# EasyEDA Pro project Buck_project.epro

# Schematic Schematic1
Board Name: Board1; Create Date: 2024-10-22; Page Name: P1; Project Name: BUCK_STM32_24V_12V; Schematic Name: Schematic1; Update Date: 2024-11-10; Company: 嘉立创EDA; Page Size: A3; Version: V1.0
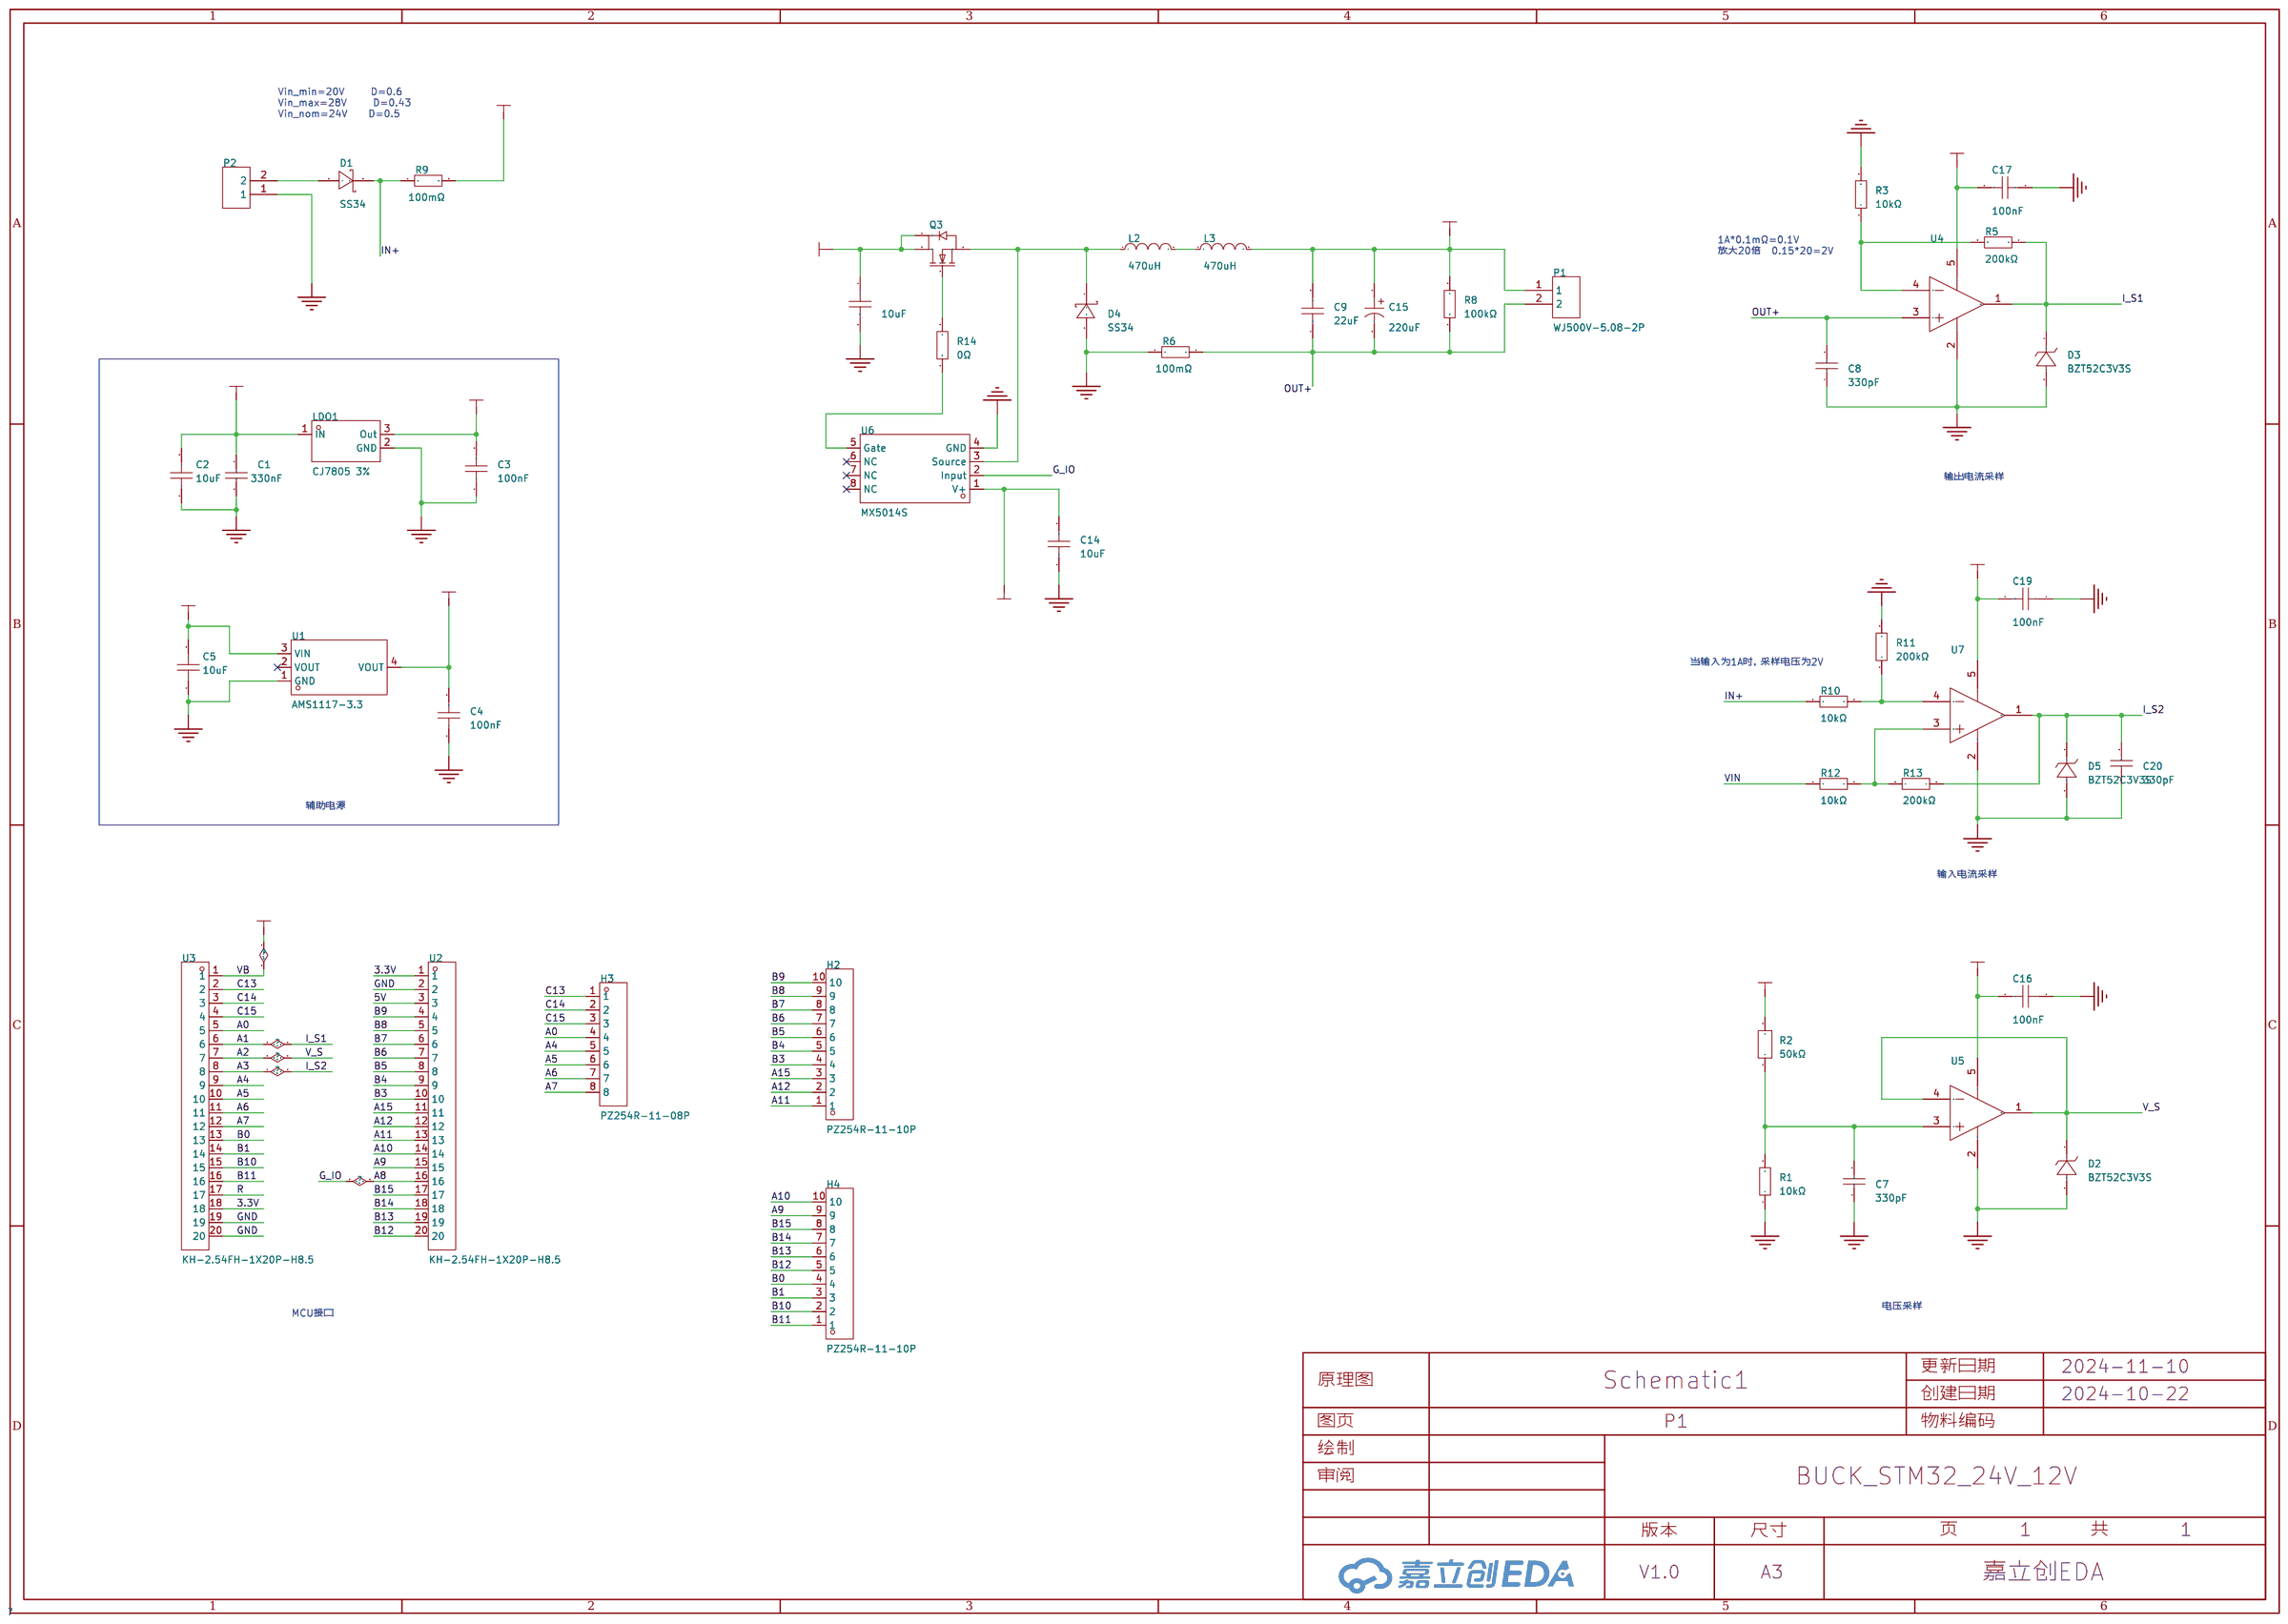
[diagram p0: schematic sheet]

## Parts
C1  330nF  [C0805]
C2  10uF  [CAP-SMD_L2.0-W1.25]
C3  100nF  [C0805]
C4  100nF  [C0805]
C5  10uF  [CAP-SMD_L2.0-W1.25]
C6  10uF  [CAP-SMD_L2.0-W1.25]
C7  330pF  [C0805]
C8  330pF  [C0805]
C9  22uF  [C1206]
C14  10uF  [C0805]
C15  220uF  [CAP-TH_BD8.0-P3.50-D0.6-FD]
C16  100nF  [C0805]
C17  100nF  [C0805]
C19  100nF  [C0805]
C20  330pF  [C0805]
D1  SS34  [SMA_L4.3-W2.6-LS5.2-RD]
D2  BZT52C3V3S  [SOD-323_L1.7-W1.3-LS2.6-RD]
D3  BZT52C3V3S  [SOD-323_L1.7-W1.3-LS2.6-RD]
D4  SS34  [SMA_L4.3-W2.6-LS5.2-RD]
D5  BZT52C3V3S  [SOD-323_L1.7-W1.3-LS2.6-RD]
H2  PZ254R-11-10P  [HDR-TH_10P-P2.54-H-M-W10.4]
H3  PZ254R-11-08P  [HDR-TH_8P-P2.54-H-M-W10.4]
H4  PZ254R-11-10P  [HDR-TH_10P-P2.54-H-M-W10.4]
L2  470uH  [IND-SMD_L12.3-W12.3_SMDRI127]
L3  470uH  [IND-SMD_L12.3-W12.3_SMDRI127]
LDO1  CJ7805 3%  [TO-252-2_L6.6-W6.1-P4.58-LS10.1-BR-CW]
P1  WJ500V-5.08-2P  [conn-th_2p-p5.00_wj500v-5.08-2p]
P2  WJ500V-5.08-2P  [conn-th_2p-p5.00_wj500v-5.08-2p]
Q3  BUK98150-55A/CUF  [SOT-223-3_L6.5-W3.4-P2.30-LS7.0-BR]
R1  10kΩ  [R0805]
R2  50kΩ  [R0805]
R3  10kΩ  [R0805]
R5  200kΩ  [R0805]
R6  100mΩ  [R1210]
R8  100kΩ  [R0805]
R9  100mΩ  [R1210]
R10  10kΩ  [R0805]
R11  200kΩ  [R0805]
R12  10kΩ  [R0805]
R13  200kΩ  [R0805]
R14  0Ω  [R0805]
U1  AMS1117-3.3  [SOT-223-3_L6.5-W3.4-P2.30-LS7.0-BR]
U2  KH-2.54FH-1X20P-H8.5  [HDR-TH_20P-P2.54-V-F-2]
U3  KH-2.54FH-1X20P-H8.5  [HDR-TH_20P-P2.54-V-F-2]
U4  TLV333IDBVR  [SOT-23-5_L2.9-W1.6-P0.95-LS2.8-BL]
U5  TLV333IDBVR  [SOT-23-5_L2.9-W1.6-P0.95-LS2.8-BL]
U6  MX5014S  [SOIC-8_L4.9-W3.9-P1.27-LS6.0-BL]
U7  TLV333IDBVR  [SOT-23-5_L2.9-W1.6-P0.95-LS2.8-BL]

## Library data of the parts
C1 = CL21B334KBFNNNE: 容值:330nF;精度:±10%;额定电压:50V;材质(温度系数):X7R;; LCSC Part Name: 330nF ±10% 50V; Supplier Part: C73142; Manufacturer: SAMSUNG(三星); Supplier Footprint: 0805; JLCPCB Part Class: 扩展库; Datasheet: https://atta.szlcsc.com/upload/public/pdf/source/20161108/1478586460960.pdf; Supplier: LCSC; Tolerance: ±10%; Voltage Rated: 50V; Temperature Coefficient: X7R
C2 C5 C6 = HGC0805R5106K500NSLJ: 容值:10uF;精度:±10%;额定电压:50V;材质(温度系数):X5R;; LCSC Part Name: 10uF ±10% 50V; Supplier Part: C22367830; Manufacturer: Chinocera(华瓷); Supplier Footprint: 0805; JLCPCB Part Class: 扩展库; Datasheet: https://atta.szlcsc.com/upload/public/pdf/source/20240326/4C0A3E12027C78BBE9280625046EA2CF.pdf; Supplier: LCSC; Tolerance: ±10%; Voltage Rated: 50V; Temperature Coefficient: X5R
C3 C4 C16 C17 C19 = CGA0603X7R104K500JT: 容值:100nF;精度:±10%;额定电压:50V;材质(温度系数):X7R;; LCSC Part Name: 100nF ±10% 50V; Supplier Part: C6119867; Manufacturer: HRE(芯声); Supplier Footprint: 0603; JLCPCB Part Class: 扩展库; Supplier: LCSC; Tolerance: ±10%; Voltage Rated: 50V; Temperature Coefficient: X7R
C7 C8 C20 = CL10C331JB8NNNC: 容值:330pF;精度:±5%;额定电压:50V;材质(温度系数):C0G;; LCSC Part Name: 330pF ±5% 50V; Supplier Part: C1664; Manufacturer: SAMSUNG(三星); Supplier Footprint: 0603; JLCPCB Part Class: 基础库; Datasheet: https://atta.szlcsc.com/upload/public/pdf/source/20160218/1457707763339.pdf; Supplier: LCSC; Tolerance: ±5%; Voltage Rated: 50V; Temperature Coefficient: C0G
C9 = CGA1206X5R226M350NT: 容值:22uF;精度:±20%;额定电压:35V;材质(温度系数):X5R;; LCSC Part Name: 22uF ±20% 35V; Supplier Part: C6119969; Manufacturer: HRE(芯声); Supplier Footprint: 1206; JLCPCB Part Class: 扩展库; Supplier: LCSC; Tolerance: ±20%; Voltage Rated: 35V; Temperature Coefficient: X5R
C14 = HGC0603R5106M160NTHJ: 容值:10uF;精度:±20%;额定电压:16V;材质(温度系数):X5R;; LCSC Part Name: 10uF ±20% 16V; Supplier Part: C7472959; Manufacturer: Chinocera(华瓷); Supplier Footprint: 0603; JLCPCB Part Class: 扩展库; Datasheet: https://atta.szlcsc.com/upload/public/pdf/source/20240320/FAC3FEC40A78BC5CCCE96C232A94D860.pdf; Supplier: LCSC; Tolerance: ±20%; Voltage Rated: 16V; Temperature Coefficient: X5R
C15 = 01EC3470: 容值:220uF;精度:±20%;额定电压:50V;纹波电流:350mA@120kHz;等效串联电阻:-;; LCSC Part Name: 220uF ±20% 50V; Supplier Part: C2836445; Manufacturer: KNSCHA(科尼盛); Supplier Footprint: 插件,D8xL12mm; JLCPCB Part Class: 扩展库; Datasheet: https://atta.szlcsc.com/upload/public/pdf/source/20210528/C2836445_4EB3DEC3C45633977FB5495C9B2E1697.pdf; Supplier: LCSC; Tolerance: ±20%; Rated Voltage: 50V; Ripple Current: 350mA@120kHz; Lead Spacing: 3.5mm; φD: 8mm; L: 12mm; Lifetime @ Temp: 2000hrs@105℃; Operating Temperature: -40℃~+105℃
D1 D4 = SS34_C8678: 二极管配置:独立式;正向压降(Vf):550mV@3A;直流反向耐压(Vr):40V;整流电流:3A;; LCSC Part Name: 电压:40V 电流:3A; Supplier Part: C8678; Manufacturer: MDD(辰达半导体); Supplier Footprint: SMA(DO-214AC); JLCPCB Part Class: 基础库; Datasheet: https://atta.szlcsc.com/upload/public/pdf/source/20230314/A80AE34493C69B89E2F4B1712F433538.pdf; Supplier: LCSC; Diode Configuration: 独立式; Forward Voltage (Vf@If): 550mV@3A; Reverse Voltage (Vr): 40V; Rectified Current: 3A; Reverse Leakage Current (Ir): 500uA@40V
D2 D3 D5 = BZT52C3V3S_C19077437: 二极管配置:独立式;稳压值(标称值):3.3V;稳压值(范围):3.1V~3.5V;功率(Pd):200mW;; Supplier Part: C19077437; Manufacturer: 宏迦橙; Supplier Footprint: SOD-323; JLCPCB Part Class: 扩展库; Datasheet: https://atta.szlcsc.com/upload/public/pdf/source/20231117/06CD1C2A69B3FFC97FEAE4263E1B2FE9.pdf; Supplier: LCSC; Diode Configuration: 独立式; Zener Voltage (Nom): 3.3V; Reverse Leakage Current (Ir): 5uA@1V; Zener Voltage (Range): 3.1V~3.5V; Power Dissipation: 200mW; Zener Impedance (Zzt): 95Ω
H2 H4 = PZ254R-11-10P: 插针结构:1x10P;间距:2.54mm;行距:-;圆针/方针:方针;安装类型:弯插;排数:单排;总PIN位数:10P;额定电流:-;额定电压:-;配合针长度:6mm;塑高:2.5mm;触头材质:黄铜;触头镀层:-;工作温度范围:-40℃~+105℃;颜色:黑色;; LCSC Part Name: 间距:2.54mm 1x10P 弯插 方针; Supplier Part: C492418; Manufacturer: XFCN(兴飞); Supplier Footprint: 弯插,P=2.54mm; JLCPCB Part Class: 扩展库; Datasheet: https://atta.szlcsc.com/upload/public/pdf/source/20200309/C492418_7D4B377DA52397FDD3F1E8B8860933B9.pdf; Supplier: LCSC; Pin Structure: 1x10P; Pitch: 2.54mm; Circluar Pins/Square Pins: 方针; Mounting Type: 弯插; Number of Rows: 单排; Number of Pins: 10P; Length of Mating Pin: 6mm; Insulation Height: 2.5mm; Contact Material: 黄铜; Operating Temperature Range: -40℃~+105℃; Color: 黑色
H3 = PZ254R-11-08P: 插针结构:1x8P;间距:2.54mm;行距:-;圆针/方针:方针;安装类型:弯插;排数:单排;总PIN位数:8P;额定电流:-;额定电压:-;配合针长度:6mm;塑高:2.5mm;触头材质:黄铜;触头镀层:-;工作温度范围:-40℃~+105℃;颜色:黑色;; LCSC Part Name: 间距:2.54mm 1x8P 弯插 方针; Supplier Part: C492416; Manufacturer: XFCN(兴飞); Supplier Footprint: 弯插,P=2.54mm; JLCPCB Part Class: 扩展库; Datasheet: https://atta.szlcsc.com/upload/public/pdf/source/20200309/C492416_50F53578DC639C00894E1D796EC334D3.pdf; Supplier: LCSC; Pin Structure: 1x8P; Pitch: 2.54mm; Circluar Pins/Square Pins: 方针; Mounting Type: 弯插; Number of Rows: 单排; Number of Pins: 8P; Length of Mating Pin: 6mm; Insulation Height: 2.5mm; Contact Material: 黄铜; Operating Temperature Range: -40℃~+105℃; Color: 黑色
L2 L3 = SMDRI127-471MT: 电感值:470uH;精度:±20%;额定电流:-;饱和电流(Isat):1.5A;类型:屏蔽电感;; LCSC Part Name: 470uH ±20% 1.5A; Supplier Part: C10153; Manufacturer: SXN(顺翔诺); Supplier Footprint: SMD,12.3x12.3mm; JLCPCB Part Class: 扩展库; Datasheet: https://atta.szlcsc.com/upload/public/pdf/source/20210810/6F96FDC19AA308DD2AD166FFB9640E87.pdf; Supplier: LCSC; Tolerance: ±20%; Saturation Current (Isat): 1.5A; DC Resistance (DCR): 980mΩ; Type: 屏蔽电感
LDO1 = CJ7805 3%: 输出类型:固定;最大输入电压:35V;输出电压:5V;最大输出电流:1.5A;输出极性:正极;; LCSC Part Name: 输入35V 输出5V 1.5A; Supplier Part: C21706; Manufacturer: CJ(江苏长电/长晶); Supplier Footprint: TO-252-2(DPAK); JLCPCB Part Class: 扩展库; Datasheet: https://atta.szlcsc.com/upload/public/pdf/source/20171228/C164904_15144413121361213907.pdf; Supplier: LCSC; Output Type: 固定; Maximum Input Voltage: 35V; Output Voltage: 5V; MAX Output Current: 1.5A; Dropout Voltage: 2V@(1A); Output Polarity: 正极; Number of Outputs: 1
P1 P2 = WJ500V-5.08-2P: 结构:1x2P;间距:5.08mm;颜色:绿色;安装方式:直插;额定电流:18A;额定电压:250V;排数:1;线规 - AWG:14~30;线规 - 平方毫米:2.5;每排PIN数:2;触头材质:-;触头镀层:-;工作温度范围:-40℃~+105℃;焊接温度(最大值):-;; LCSC Part Name: 1x2P 5.08mm 直插 排数:1 每排P数:2; Supplier Part: C8465; Manufacturer: KANGNEX(康奈克斯电气); Supplier Footprint: 插件,P=5.08mm; JLCPCB Part Class: 扩展库; Datasheet: https://atta.szlcsc.com/upload/public/pdf/source/20191225/C8465_02D34CE5B5B4A53DF5891601D97FA9F4.pdf; Supplier: LCSC; Structure: 1x2P; Pitch: 5.08mm; Color: 绿色; Mounting Style: 直插; Current Rating (Max): 18A; Voltage Rating (Max): 250V; Number of Pins: 2P; Number of Rows: 1; Wire Gauge - AWG: 14~30; Wire Gauge - mm2: 2.5; Number of PINs Per Row: 2; Operating Temperature Range: -40℃~+105℃; Screw Specification: M2.5
Q3 = BUK98150-55A/CUF: 类型:1个N沟道;漏源电压(Vdss):55V;连续漏极电流(Id):5.5A;功率(Pd):8W;导通电阻(RDS(on)@Vgs,Id):137mΩ@10V,5A;阈值电压(Vgs(th)@Id):2V@1mA;; LCSC Part Name: 1个N沟道 耐压:55V 电流:5.5A; Supplier Part: C458219; Manufacturer: Nexperia(安世); Supplier Footprint: SOT-223-3; JLCPCB Part Class: 扩展库; Datasheet: https://atta.szlcsc.com/upload/public/pdf/source/20191121/C458219_4BA6FEB91EB7C469429BA4E15CAC82FB.pdf; Supplier: LCSC; Type: 1个N沟道; Drain Source Voltage (Vdss): 55V; Continuous Drain Current (Id): 5.5A; Power Dissipation (Pd): 8W; Drain Source On Resistance (RDS(on)@Vgs,Id): 137mΩ@10V,5A; Gate Threshold Voltage (Vgs(th)@Id): 2V@1mA; Total Gate Charge (Qg@Vgs): 5.3nC@5V; Input Capacitance (Ciss@Vds): 320pF@25V; Operating Temperature: -55℃~+150℃@(Tj)
R1 R3 R10 R12 = 0603WAF1002T5E: 电阻类型:厚膜电阻;阻值:10kΩ;精度:±1%;功率:100mW;最大工作电压:75V;温度系数:±100ppm/℃;; LCSC Part Name: 厚膜电阻 10kΩ ±1% 100mW; Supplier Part: C25804; Manufacturer: UNI-ROYAL(厚声); Supplier Footprint: 0603; JLCPCB Part Class: 基础库; Datasheet: https://atta.szlcsc.com/upload/public/pdf/source/20200306/C422600_1E6D84923E4A46A82E41ADD87F860B5C.pdf; Supplier: LCSC; Type: 厚膜电阻; Tolerance: ±1%; Power(Watts): 100mW; Overload Voltage (Max): 75V; Temperature Coefficient: ±100ppm/℃; Operating Temperature Range: -55℃~+155℃
R2 = RT0603BRD0750KL: 电阻类型:薄膜电阻;阻值:50kΩ;精度:±0.1%;功率:100mW;最大工作电压:-;温度系数:±25ppm/℃;; LCSC Part Name: 薄膜电阻 50kΩ ±0.1% 100mW; Supplier Part: C861451; Manufacturer: YAGEO(国巨); Supplier Footprint: 0603; JLCPCB Part Class: 扩展库; Datasheet: https://atta.szlcsc.com/upload/public/pdf/source/20200610/C326738_5639A9F1B6EB6E4AE2197577D3456E7F.pdf; Supplier: LCSC; Type: 薄膜电阻; Tolerance: ±0.1%; Power(Watts): 100mW; Temperature Coefficient: ±25ppm/℃; Operating Temperature Range: -55℃~+155℃
R5 R11 R13 = 0603WAF2003T5E: 电阻类型:厚膜电阻;阻值:200kΩ;精度:±1%;功率:100mW;最大工作电压:75V;温度系数:±100ppm/℃;; LCSC Part Name: 200kΩ ±1% 100mW 厚膜电阻; Supplier Part: C25811; Manufacturer: UNI-ROYAL(厚声); Supplier Footprint: 0603; JLCPCB Part Class: 基础库; Datasheet: https://atta.szlcsc.com/upload/public/pdf/source/20200306/C422600_1E6D84923E4A46A82E41ADD87F860B5C.pdf; Supplier: LCSC; Type: 厚膜电阻; Tolerance: ±1%; Power(Watts): 100mW; Overload Voltage (Max): 75V; Temperature Coefficient: ±100ppm/℃; Operating Temperature Range: -55℃~+155℃
R6 R9 = 1210W2F100LT5E: 电阻类型:厚膜电阻;阻值:100mΩ;精度:±1%;功率:500mW;最大工作电压:200V;温度系数:±800ppm/℃;; LCSC Part Name: 100mΩ ±1% 500mW 厚膜电阻; Supplier Part: C270892; Manufacturer: UNI-ROYAL(厚声); Supplier Footprint: 1210; JLCPCB Part Class: 扩展库; Datasheet: https://atta.szlcsc.com/upload/public/pdf/source/20200306/C422600_1E6D84923E4A46A82E41ADD87F860B5C.pdf; Supplier: LCSC; Type: 厚膜电阻; Tolerance: ±1%; Power(Watts): 500mW; Overload Voltage (Max): 200V; Temperature Coefficient: ±800ppm/℃; Operating Temperature Range: -55℃~+155℃
R8 = 0603WAF1003T5E: 电阻类型:厚膜电阻;阻值:100kΩ;精度:±1%;功率:100mW;最大工作电压:75V;温度系数:±100ppm/℃;; LCSC Part Name: 100kΩ ±1% 100mW 厚膜电阻; Supplier Part: C25803; Manufacturer: UNI-ROYAL(厚声); Supplier Footprint: 0603; JLCPCB Part Class: Basic Part; Datasheet: https://atta.szlcsc.com/upload/public/pdf/source/20200306/C422600_1E6D84923E4A46A82E41ADD87F860B5C.pdf; Supplier: LCSC; Type: 厚膜电阻; Tolerance: ±1%; Power(Watts): 100mW; Overload Voltage (Max): 75V; Temperature Coefficient: ±100ppm/℃; Operating Temperature Range: -55℃~+155℃
R14 = 0603WAF0000T5E: 电阻类型:厚膜电阻;阻值:0Ω;精度:±1%;功率:100mW;最大工作电压:75V;; LCSC Part Name: 0Ω ±1% 100mW 厚膜电阻; Supplier Part: C21189; Manufacturer: UNI-ROYAL(厚声); Supplier Footprint: 0603; JLCPCB Part Class: 基础库; Datasheet: https://atta.szlcsc.com/upload/public/pdf/source/20200306/C422600_1E6D84923E4A46A82E41ADD87F860B5C.pdf; Supplier: LCSC; Type: 厚膜电阻; Tolerance: ±1%; Power(Watts): 100mW; Overload Voltage (Max): 75V; Operating Temperature Range: -55℃~+155℃
U1 = AMS1117-3.3_C6186: 输出类型:固定;最大输入电压:-;输出电压:3.3V;最大输出电流:1A;电源纹波抑制比(PSRR):72dB@(120Hz);输出极性:正极;; LCSC Part Name: 输出3.3V 1A; Supplier Part: C6186; Manufacturer: AMS; Supplier Footprint: SOT-223; JLCPCB Part Class: 基础库; Datasheet: https://atta.szlcsc.com/upload/public/pdf/source/20180727/C6186_7A095716F0823C02F1997A905E26C086.pdf; Supplier: LCSC; Output Type: 固定; Output Voltage: 3.3V; MAX Output Current: 1A; Power Supply Rejection Ratio (PSRR): 72dB@(120Hz); Dropout Voltage: 1.3V@(800mA); Output Polarity: 正极; Number of Outputs: 1
U2 U3 = KH-2.54FH-1X20P-H8.5: 插孔结构:1x20P;间距:2.54mm;行距:-;圆孔/方孔:方孔;安装类型:直插;排数:单排;总孔位数:20P;额定电流:3A;额定电压:-;插孔方向:顶部;塑高:8.5mm;工作温度范围:-40℃~+105℃;; LCSC Part Name: 间距:2.54mm 1x20P 直插; Supplier Part: C2905423; Manufacturer: kinghelm(金航标); Supplier Footprint: 插件,P=2.54mm; JLCPCB Part Class: 扩展库; Datasheet: https://atta.szlcsc.com/upload/public/pdf/source/20211019/BDB673907948473CE61C8A1CF06C5BF5.pdf; Supplier: LCSC; Holes Structure: 1x20P; Pitch: 2.54mm; Circular Hole / Square Hole: 方孔; Mounting Type: 直插; Number of Rows: 单排; Number of Holes: 20P; Current Rating (Max): 3A; Holes Direction: 顶部; Insulation Height: 8.5mm; Operating Temperature Range: -40℃~+105℃
U4 U5 U7 = TLV333IDBVR: 放大器数:单路;增益带宽积(GBP):350kHz;输入偏置电流(Ib):70pA;输入失调电压(Vos):2uV;压摆率(SR):0.16V/us;轨到轨:-;; Supplier Part: C473369; Manufacturer: TI(德州仪器); Supplier Footprint: SOT-23-5; JLCPCB Part Class: 扩展库; Datasheet: https://www.ti.com/cn/lit/gpn/tlv333; Supplier: LCSC; Number of Circuits: 单路; Gain Bandwidth Product(GBP): 350kHz; Current - Input Bias(Ib): 70pA; Voltage - Input Offset(Vos): 2uV; Slew Rate(SR): 0.16V/us; Operating Temperature: -40℃~+125℃
U6 = MX5014S: 驱动配置:高边;; LCSC Part Name: 高边驱动; Supplier Part: C5359091; Manufacturer: Wuxi Maxinmicro(无锡明芯微); Supplier Footprint: SOP-8L; JLCPCB Part Class: 扩展库; Datasheet: https://atta.szlcsc.com/upload/public/pdf/source/20230209/33EE770FFA27735255664B6163A2CBF6.pdf; Supplier: LCSC; Driven Configuration: 高边

## Nets
3.3V: C4.2 C16.2 C17.2 C19.2 U1.4(VOUT) U2.1 U3.1 U3.18 U4.5(V+) U5.5(V+) U7.5(V+)
5V: C3.2 C5.2 LDO1.3(Out) U1.3(VIN) U2.3
GND: C1.1 C2.1 C3.1 C4.1 C5.1 C6.2 C7.1 C8.1 C14.1 C16.1 C17.1 C19.1 C20.1 D2.2(A) D3.2(A) D4.2(A) D5.2(A) LDO1.2(GND) P2.1 R1.1 R3.2 R6.1 R11.2 U1.1(GND) U2.2 U3.19 U3.20 U4.2(V-) U5.2(V-) U6.4(GND) U7.2(V-)
VIN: C1.2 C2.2 C6.1 C14.2 LDO1.1(IN) Q3.2(D) Q3.4(D) R9.2 R12.2 U6.1(V+)
A0: H3.4 U3.5
A1: D3.1(K) R5.1 U3.6 U4.1(OUT)
A2: D2.1(K) U3.7 U5.1(OUT) U5.4(IN-)
A3: C20.2 D5.1(K) R13.1 U3.8 U7.1(OUT)
A4: H3.5 U3.9
A5: H3.6 U3.10
A6: H3.7 U3.11
A7: H3.8 U3.12
A8: U2.16 U6.2(Input)
A9: H4.9 U2.15
A10: H4.10 U2.14
A11: H2.1 U2.13
A12: H2.2 U2.12
A15: H2.3 U2.11
B0: H4.4 U3.13
B1: H4.3 U3.14
B3: H2.4 U2.10
B4: H2.5 U2.9
B5: H2.6 U2.8
B6: H2.7 U2.7
B7: H2.8 U2.6
B8: H2.9 U2.5
B9: H2.10 U2.4
B10: H4.2 U3.15
B11: H4.1 U3.16
B12: H4.5 U2.20
B13: H4.6 U2.19
B14: H4.7 U2.18
B15: H4.8 U2.17
C13: H3.1 U3.2
C14: H3.2 U3.3
C15: H3.3 U3.4
IN+: D1.1(K) R9.1 R10.2
OUT+: C8.2 C9.1 C15.2 P1.2 R6.2 R8.1 U4.3(IN+)
R: U3.17
VOUT: C9.2 C15.1 L3.2 P1.1 R2.2 R8.2
$1N156: D1.2(A) P2.2
$1N2005: C7.2 R1.2 R2.1 U5.3(IN+)
$1N2404: R3.1 R5.2 U4.4(IN-)
$1N3649: D4.1(K) L2.1 Q3.3(S) U6.3(Source)
$1N4687: L2.2 L3.1
$1N6608: R12.1 R13.2 U7.3(IN+)
$1N6687: R10.1 R11.1 U7.4(IN-)
$1N9222: R14.1 U6.5(Gate)
$1N9225: Q3.1(G) R14.2

Not connected (* = marked no-connect by the designer): U1 2(VOUT)*; U6 6(NC)* 7(NC)* 8(NC)*

## Notes on the sheet
- Vin_min=20V     D=0.6
  Vin_max=28V     D=0.43
  Vin_nom=24V    D=0.5
- 1A*0.1mΩ=0.1V
  放大20倍  0.15*20=2V
- 输出电流采样
- 当输入为1A时，采样电压为2V
- 辅助电源
- 输入电流采样
- 电压采样
- MCU接口

# Board PCB1
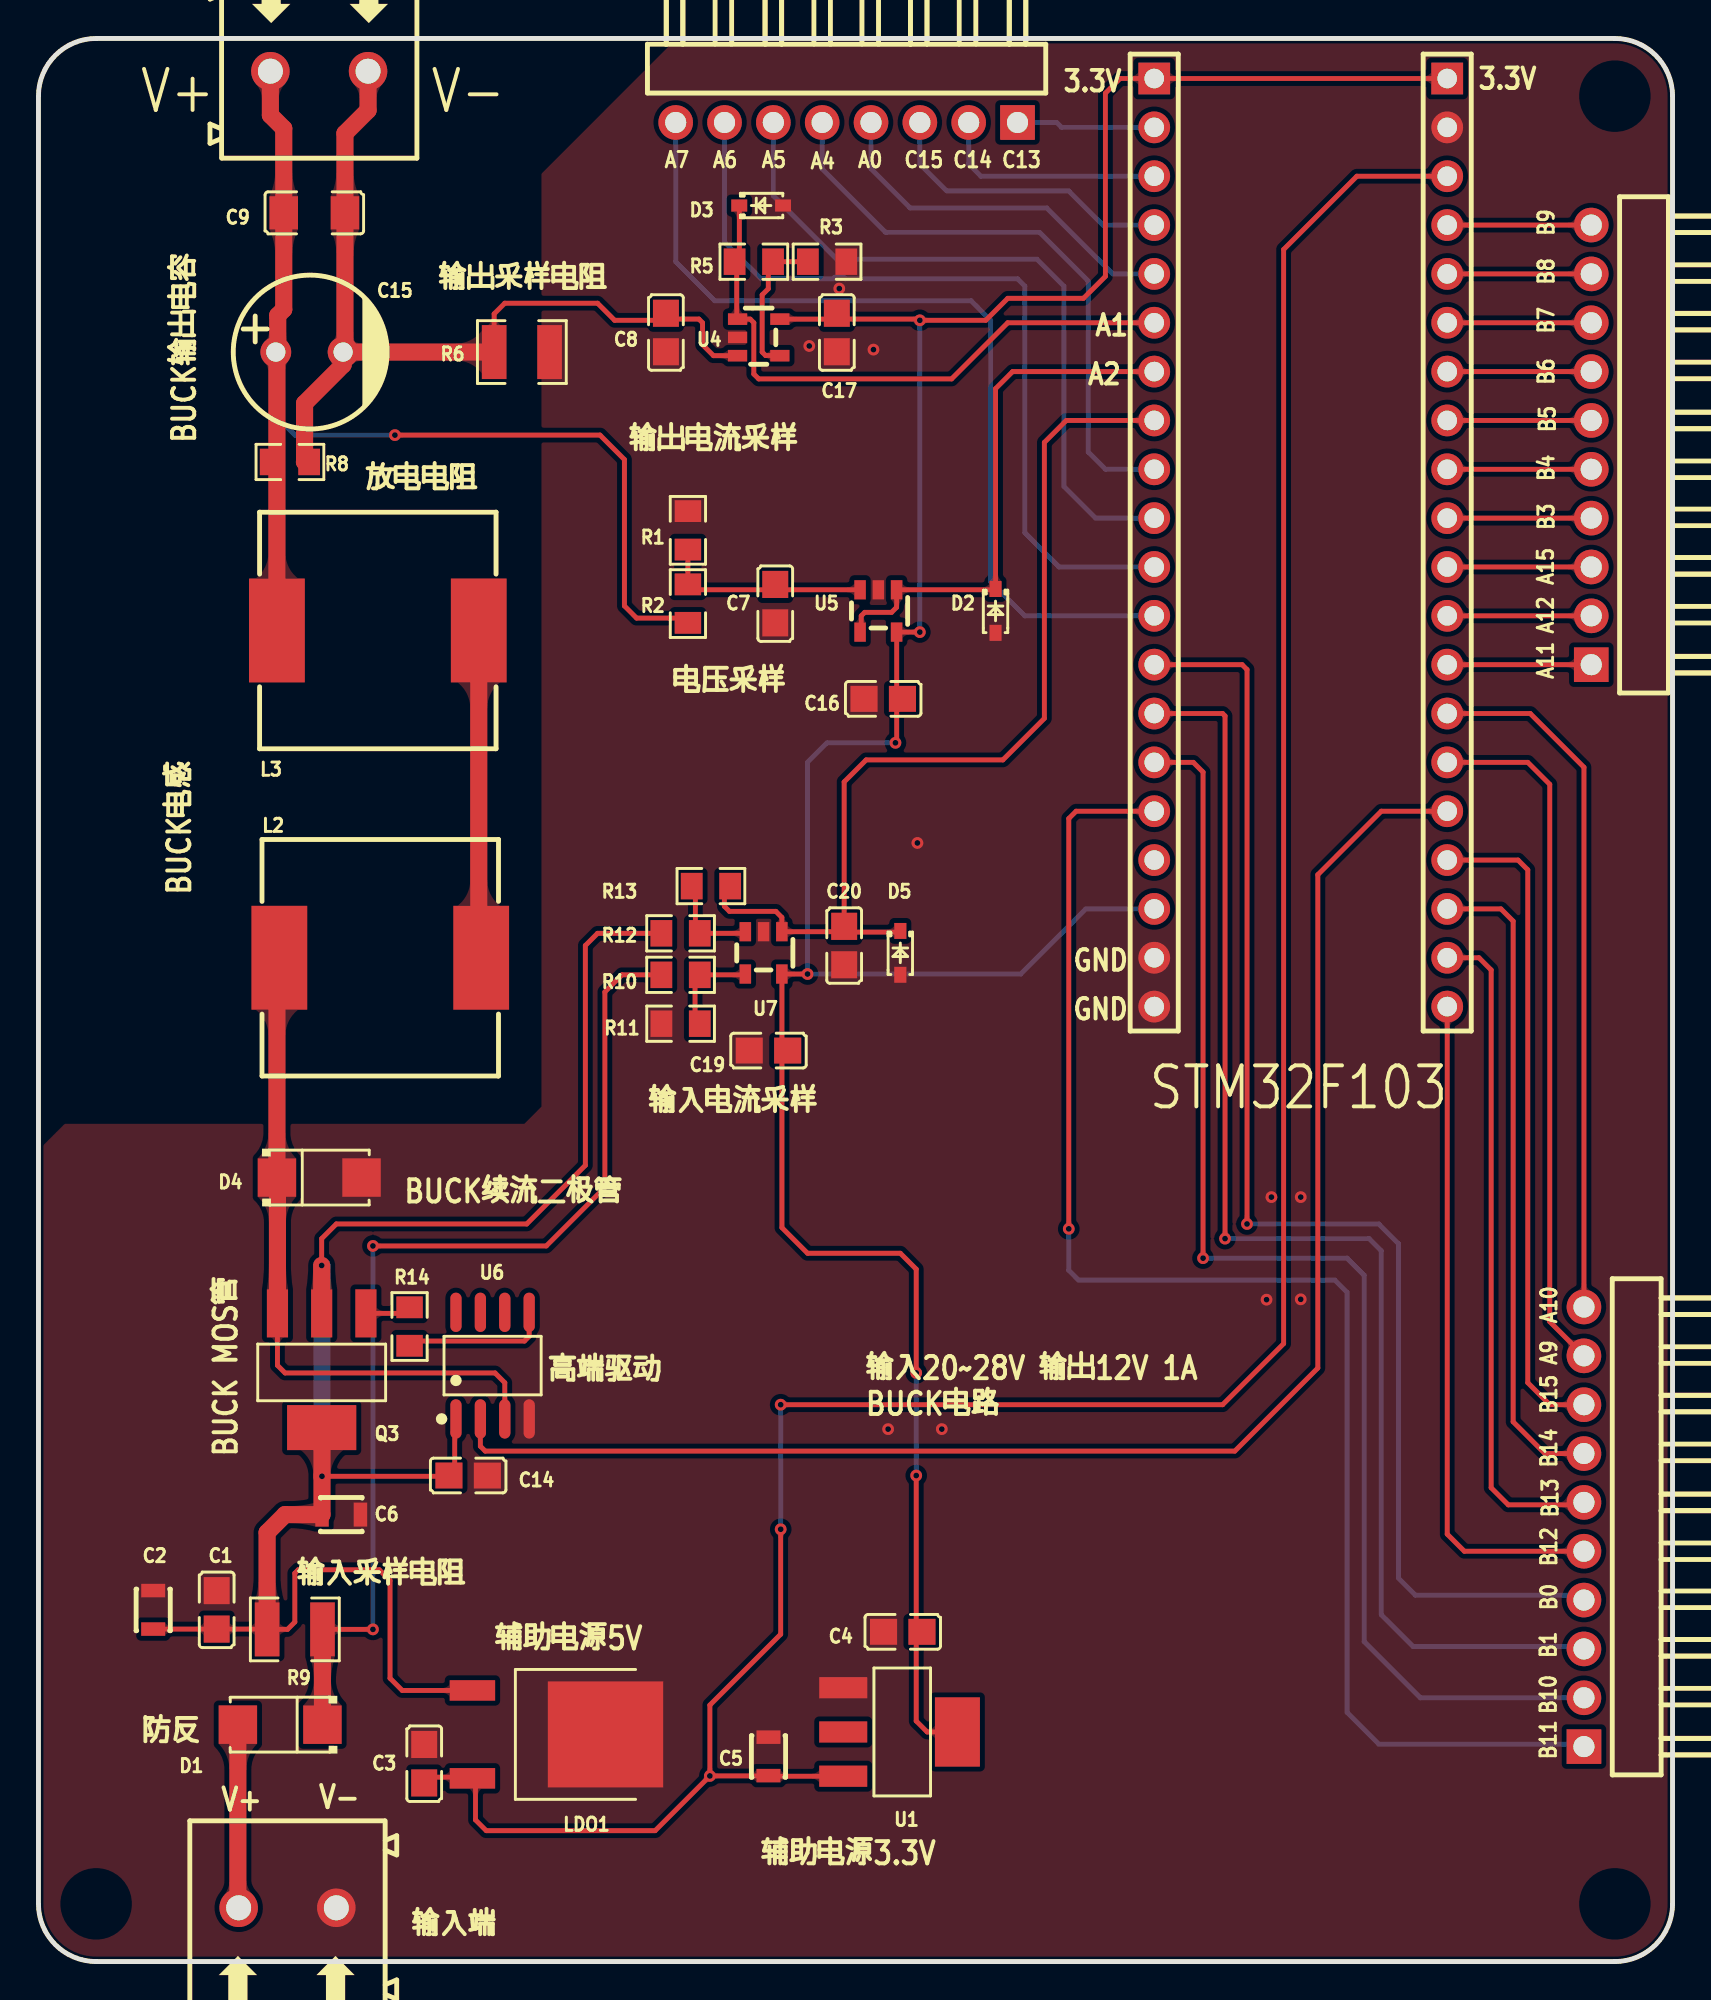
[diagram p1: board, top side]
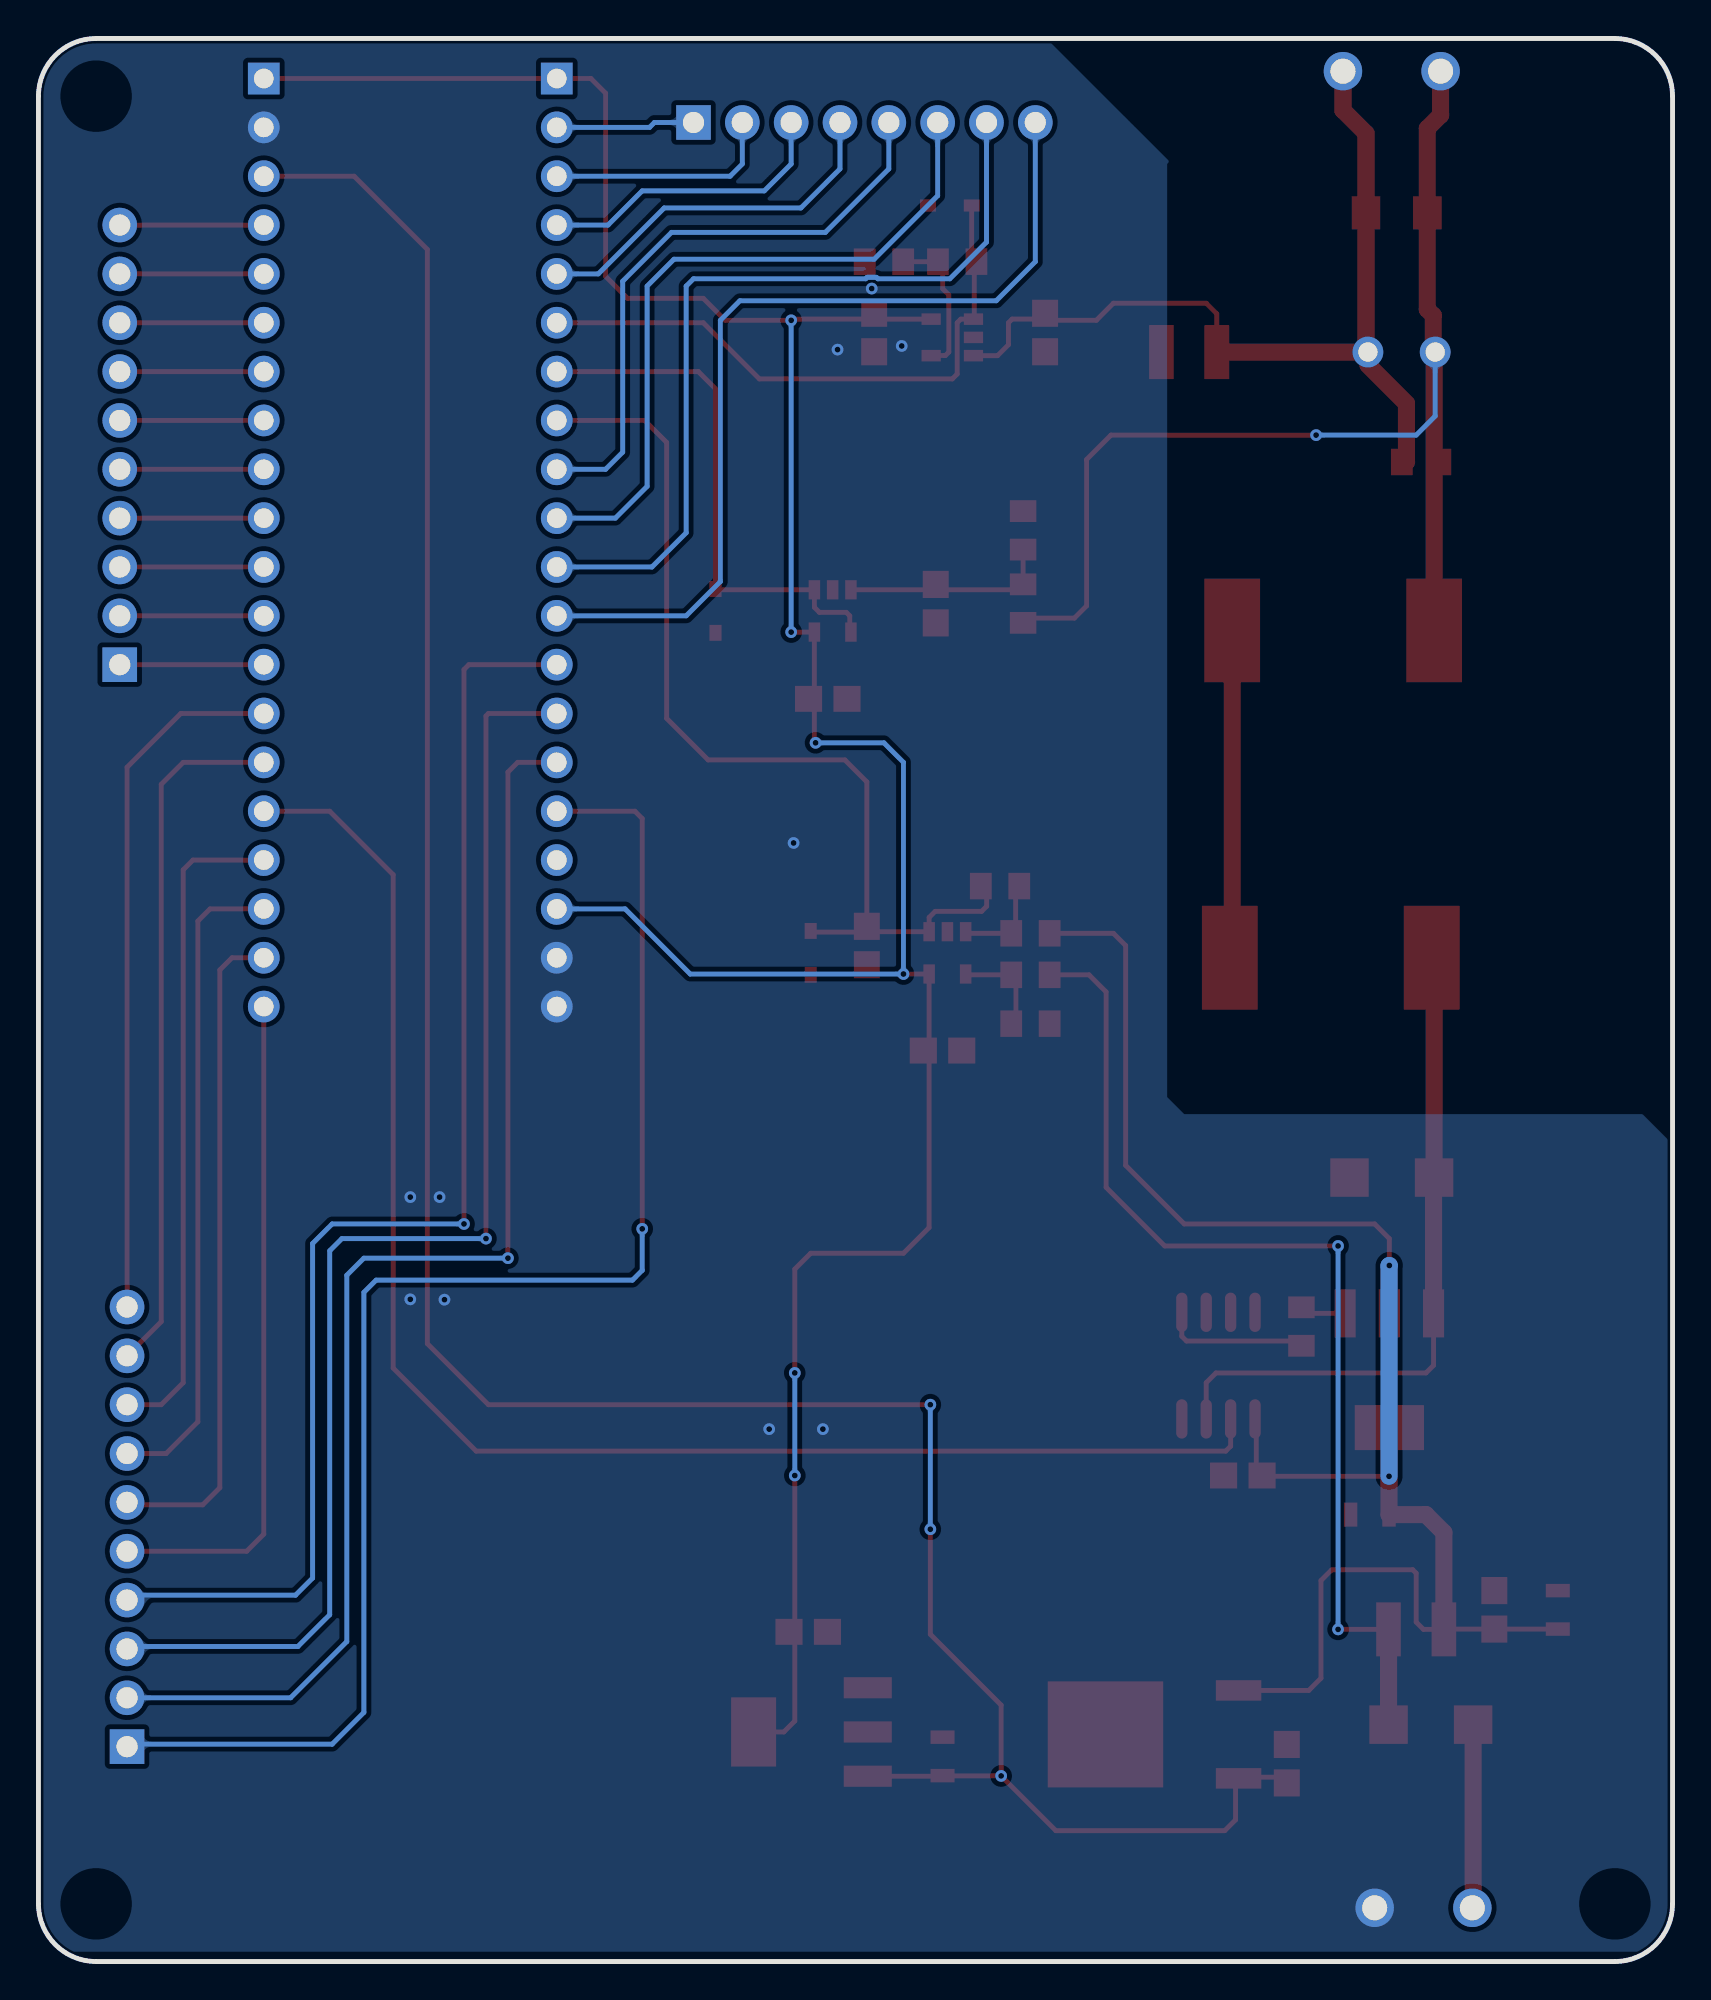
[diagram p2: board, bottom side, seen from below]

Outline 85 x 100 mm; copper layers: Top Layer, Bottom Layer. Coordinates in mm from the lower left corner of the outline.
Outline path: 0,97 0,3 arc(0.88,0.88) 3,0 82,0 arc(84.12,0.88) 85,3 85,97 arc(84.12,99.12) 82,100 3,100 arc(0.88,99.12) 0,97
Stack: Top Layer 0.035mm / Dielectric1 1.51mm FR4 er 4.5 / Bottom Layer 0.035mm

## Design rules (mm)
template: 自定义配置
spacing copperThickness1oz (default): track to track 0.102, other pairs 0.152 to 0.3
spacing copperThickness2oz: track to track 0.203, other pairs 0.152 to 0.3
track width copperThickness1oz (default): min 0.127, default 0.254, max 2.54
track width copperThickness2oz: min 0.203, default 0.254, max 2.54
differential pair differentialPair (default): width min 0.127, default 0.254, max 2.54; gap min 0.152, default 0.152
via viaSize (default): diameter min 0.5, default 0.61, max 10; hole min 0.3, default 0.305, max 6.3

## Placement (name value [footprint] x y rotation side)
C1  330nF  [C0805]  9.27 18.29 270 top
C2  10uF  [CAP-SMD_L2.0-W1.25]  5.97 18.29 270 top
C3  100nF  [C0805]  20.07 10.29 270 top
C4  100nF  [C0805]  44.96 17.15 0 top
C5  10uF  [CAP-SMD_L2.0-W1.25]  37.97 10.67 270 top
C6  10uF  [CAP-SMD_L2.0-W1.25]  15.75 23.24 0 top
C7  330pF  [C0805]  38.33 70.61 90 top
C8  330pF  [C0805]  32.64 84.71 90 top
C9  22uF  [C1206]  14.35 90.93 180 top
C14  10uF  [C0805]  22.35 25.27 180 top
C15  220uF  [CAP-TH_BD8.0-P3.50-D0.6-FD]  14.1 83.69 0 top
C16  100nF  [C0805]  43.94 65.66 0 top
C17  100nF  [C0805]  41.53 84.71 90 top
C19  100nF  [C0805]  37.97 47.37 0 top
C20  330pF  [C0805]  41.91 52.83 90 top
D1  SS34  [SMA_L4.3-W2.6-LS5.2-RD]  12.57 12.32 180 top
D2  BZT52C3V3S  [SOD-323_L1.7-W1.3-LS2.6-RD]  49.78 70.23 270 top
D3  BZT52C3V3S  [SOD-323_L1.7-W1.3-LS2.6-RD]  37.59 91.31 0 top
D4  SS34  [SMA_L4.3-W2.6-LS5.2-RD]  14.61 40.77 0 top
D5  BZT52C3V3S  [SOD-323_L1.7-W1.3-LS2.6-RD]  44.83 52.45 270 top
H2  PZ254R-11-10P  [HDR-TH_10P-P2.54-H-M-W10.4]  80.77 78.87 90 top
H3  PZ254R-11-08P  [HDR-TH_8P-P2.54-H-M-W10.4]  42.04 95.63 180 top
H4  PZ254R-11-10P  [HDR-TH_10P-P2.54-H-M-W10.4]  80.39 22.61 90 top
L2  470uH  [IND-SMD_L12.3-W12.3_SMDRI127]  17.78 52.2 0 top
L3  470uH  [IND-SMD_L12.3-W12.3_SMDRI127]  17.65 69.22 180 top
LDO1  CJ7805 3%  [TO-252-2_L6.6-W6.1-P4.58-LS10.1-BR-CW]  26.03 11.81 180 top
P1  WJ500V-5.08-2P  [conn-th_2p-p5.00_wj500v-5.08-2p]  14.61 98.3 0 top
P2  WJ500V-5.08-2P  [conn-th_2p-p5.00_wj500v-5.08-2p]  12.95 2.79 180 top
Q3  BUK98150-55A/CUF  [SOT-223-3_L6.5-W3.4-P2.30-LS7.0-BR]  14.73 30.73 90 top
R1  10kΩ  [R0805]  33.78 74.42 270 top
R2  50kΩ  [R0805]  33.78 70.61 270 top
R3  10kΩ  [R0805]  41.02 88.39 0 top
R5  200kΩ  [R0805]  37.21 88.39 0 top
R6  100mΩ  [R1210]  25.15 83.69 180 top
R8  100kΩ  [R0805]  13.08 77.98 180 top
R9  100mΩ  [R1210]  13.33 17.27 180 top
R10  10kΩ  [R0805]  33.4 51.31 180 top
R11  200kΩ  [R0805]  33.4 48.77 180 top
R12  10kΩ  [R0805]  33.4 53.47 180 top
R13  200kΩ  [R0805]  34.98 55.92 180 top
R14  0Ω  [R0805]  19.3 33.02 90 top
U1  AMS1117-3.3  [SOT-223-3_L6.5-W3.4-P2.30-LS7.0-BR]  44.83 11.94 180 top
U2  KH-2.54FH-1X20P-H8.5  [HDR-TH_20P-P2.54-V-F-2]  73.28 73.79 270 top
U3  KH-2.54FH-1X20P-H8.5  [HDR-TH_20P-P2.54-V-F-2]  58.04 73.79 270 top
U4  TLV333IDBVR  [SOT-23-5_L2.9-W1.6-P0.95-LS2.8-BL]  37.47 84.45 270 top
U5  TLV333IDBVR  [SOT-23-5_L2.9-W1.6-P0.95-LS2.8-BL]  43.69 70.23 180 top
U6  MX5014S  [SOIC-8_L4.9-W3.9-P1.27-LS6.0-BL]  23.62 30.99 0 top
U7  TLV333IDBVR  [SOT-23-5_L2.9-W1.6-P0.95-LS2.8-BL]  37.72 52.45 180 top

## Footprints (pads in the part's own frame, mm; a bottom-side part is the same pattern mirrored in y, then rotated)
C0805
  rect 1.41x1.35 smd: 1(-1,0) 2(1,0)
C1206
  rect 1.485x1.728 smd: 1(-1.593,0) 2(1.593,0)
CAP-SMD_L2.0-W1.25
  rect 0.7x1.25 smd: 1(-1,0) 2(1,0)
CAP-TH_BD8.0-P3.50-D0.6-FD
  round 1.6 hole 1: 1(-1.75,0) 2(1.75,0)
conn-th_2p-p5.00_wj500v-5.08-2p
  round 2 hole 1.3: 1(-2.54,0) 2(2.54,0)
HDR-TH_8P-P2.54-H-M-W10.4
  rect 1.8x1.8 hole 1.1: 1(-8.89,0)
  round 1.8 hole 1.1: 2(-6.35,0) 3(-3.81,0) 4(-1.27,0) 5(1.27,0) 6(3.81,0) 7(6.35,0) 8(8.89,0)
HDR-TH_10P-P2.54-H-M-W10.4
  rect 1.8x1.8 hole 1.1: 1(-11.43,0)
  round 1.8 hole 1.1: 2(-8.89,0) 3(-6.35,0) 4(-3.81,0) 5(-1.27,0) 6(1.27,0) 7(3.81,0) 8(6.35,0) 9(8.89,0) 10(11.43,0)
HDR-TH_20P-P2.54-V-F-2
  rect 1.65x1.65 hole 1.02: 1(-24.13,0)
  round 1.65 hole 1.02: 2(-21.59,0) 3(-19.05,0) 4(-16.51,0) 5(-13.97,0) 6(-11.43,0) 7(-8.89,0) 8(-6.35,0) 9(-3.81,0) 10(-1.27,0) 11(1.27,0) 12(3.81,0) 13(6.35,0) 14(8.89,0) 15(11.43,0) 16(13.97,0) 17(16.51,0) 18(19.05,0) 19(21.59,0) 20(24.13,0)
IND-SMD_L12.3-W12.3_SMDRI127
  rect 2.9x5.4 smd: 1(-5.25,0) 2(5.25,0)
R0805
  rect 1.133x1.377 smd: 1(-1,0) 2(1,0)
R1210
  rect 1.282x2.808 smd: 1(-1.441,0) 2(1.441,0)
SMA_L4.3-W2.6-LS5.2-RD
  rect 2x2 smd: 1(-2.2,0) 2(2.2,0)
SOD-323_L1.7-W1.3-LS2.6-RD
  rect 0.83x0.63 smd: 1(-1.14,0) 2(1.14,0)
SOIC-8_L4.9-W3.9-P1.27-LS6.0-BL
  oval 0.588x2.045 smd: 1(-1.905,-2.772) 2(-0.635,-2.772) 3(0.635,-2.772) 4(1.905,-2.772) 5(1.905,2.772) 6(0.635,2.772) 7(-0.635,2.772) 8(-1.905,2.772)
SOT-23-5_L2.9-W1.6-P0.95-LS2.8-BL
  rect 0.6x1 smd: 1(-0.95,-1.1) 2(0,-1.1) 3(0.95,-1.1) 4(0.95,1.1) 5(-0.95,1.1)
SOT-223-3_L6.5-W3.4-P2.30-LS7.0-BR
  rect 2.5x1.1 smd: 1(2.97,-2.3) 2(2.97,0) 3(2.97,2.3)
  rect 2.34x3.6 smd: 4(-2.97,0)
TO-252-2_L6.6-W6.1-P4.58-LS10.1-BR-CW
  rect 2.364x1.064 smd: 1(3.462,-2.286) 3(3.462,2.286)
  rect 6.004x5.512 smd: 2(-3.462,0)

## Nets
As in the schematic.

Pads without a net: U1 2; U6 6 7 8

## Via types
v1: diameter 0.61, hole 0.305, Top Layer to Bottom Layer, 28 vias

## Routing (per net, layer and track width the routed paths; a pad name or vN(x,y) marks a point on that pad's centre or on a via; arc(x,y) is an arc through that point)
3.3V: length 152.5
  Top Layer w0.254: v1(45.85,69.13) U5.5 44.64,69.13 44.64,63.44 v1(44.58,63.37) ; v1(45.66,25.27) 45.66,12.51 46.23,11.94 U1.4 ; U4.5 41.53,85.41 41.53,85.41 45.81,85.41 45.85,85.37 v1(45.85,85.34) 49.28,85.34 50.42,86.49 54.36,86.49 55.5,87.63 55.5,97.16 56.26,97.92 U3.1 U2.1 ; v1(40,51.35) U7.5 38.67,51.35 38.67,38.16 40,36.83 44.83,36.83 45.66,36 v1(45.66,30.61)
  Bottom Layer w0.254: v1(45.85,85.34) v1(45.85,69.13) ; 58.04,54.74 54.48,54.74 51.1,51.35 v1(40,51.35) 40,62.36 41.02,63.37 v1(44.58,63.37) ; v1(45.66,25.27) v1(45.66,30.61)
5V: length 140.7
  Top Layer w0.254: v1(38.61,22.48) 38.61,17.02 34.93,13.34 v1(34.93,9.65) ; LDO1.3 22.51,9.59 20.07,9.59 ; v1(34.93,9.65) 38.21,9.65 38.23,9.64 41.86,9.64 U1.3 ; v1(34.93,9.65) 32.08,6.81 23.29,6.81 22.73,7.37 22.73,9.14 22.35,9.53 ; v1(38.61,28.96) 61.59,28.96 64.77,32.13 64.77,89.03 68.58,92.84 U2.3
  Bottom Layer w0.254: v1(38.61,22.48) v1(38.61,28.96)
GND:
  vias: v1(40.1,84.01) v1(41.66,87) v1(43.43,83.82) v1(44.2,27.69) v1(45.72,58.17) v1(46.99,27.69) v1(63.88,34.42) v1(64.13,39.75) v1(65.66,39.75) v1(65.66,34.44)
VIN: length 93.7
  Top Layer w0.254: 32.65,53.47 29.08,53.47 28.45,52.83 28.45,41.4 25.4,38.35 15.49,38.35 14.73,37.59 v1(14.73,36.19) ; v1(14.75,25.23) 21.1,25.23 21.14,25.27 21.65,25.27 21.65,28.15 U6.1 ; LDO1.1 18.92,14.1 18.29,14.73 18.29,19.81 17.73,20.37 13.51,20.37 13.33,20.19 13.33,17.65 12.95,17.27 R9.2 11.88,17.29 C1.2 C2.2
  Top Layer w0.889: R9.2 11.89,22.31 12.83,23.24 C6.1 v1(14.75,25.23) 14.75,27.75 Q3.4 ; Q3.2 v1(14.73,36.19)
  Bottom Layer w0.889: v1(14.75,25.23) 14.75,36.18 v1(14.73,36.19)
A0: length 19.4
  Bottom Layer w0.254: U3.5 55.88,87.76 52.45,91.19 45.34,91.19 43.31,93.22 H3.4
A1: length 31.7
  Top Layer w0.254: 36.32,88.4 36.32,85.45 U4.1 37.02,85.41 37.21,85.22 37.21,82.55 37.47,82.3 47.5,82.3 50.42,85.22 58.04,85.22 ; 36.46,88.39 36.46,91.31 D3.1
A2: length 28
  Top Layer w0.254: U3.7 50.67,82.68 49.78,81.79 D2.1 49.74,71.33 44.64,71.33 44.64,70.42 44.38,70.16 42.98,70.16 42.8,69.98 42.8,69.19 U5.4
A3: length 51.4
  Top Layer w0.254: 41.91,53.53 41.89,53.55 38.67,53.55 38.67,54.3 38.35,54.61 35.94,54.61 35.68,54.87 35.68,56.01 ; 41.91,53.53 44.77,53.53 D5.1 ; 41.91,53.53 41.91,61.34 43.05,62.48 50.16,62.48 52.32,64.64 52.32,78.99 53.47,80.14 U3.8
A4: length 31.4
  Bottom Layer w0.254: 58.04,77.6 55.5,77.6 54.61,78.49 54.61,87.38 52.07,89.92 44.07,89.92 40.77,93.22 H3.5
A5: length 36.7
  Bottom Layer w0.254: U3.10 54.99,75.06 53.34,76.71 53.34,87.12 51.94,88.52 41.53,88.52 38.23,91.82 H3.6
A6: length 43.1
  Bottom Layer w0.254: H3.7 35.69,89.41 37.59,87.5 41.34,87.5 41.41,87.58 41.9,87.58 41.97,87.5 50.93,87.5 51.31,87.12 51.31,74.3 53.09,72.52 58.04,72.52
A7: length 47.7
  Bottom Layer w0.254: U3.12 51.31,69.98 49.53,71.75 49.53,85.34 48.51,86.36 35.18,86.36 33.15,88.39 H3.8
A8: length 80.6
  Top Layer w0.254: U6.2 22.99,26.8 23.24,26.54 62.23,26.54 66.55,30.86 66.55,56.52 69.85,59.82 U2.16
A9: length 36.3
  Top Layer w0.254: U2.15 77.47,62.36 78.61,61.21 78.61,33.27 H4.9
A10: length 36.3
  Top Layer w0.254: H4.10 80.39,62.1 77.6,64.9 U2.14
A11: length 7.5
  Top Layer w0.254: 73.28,67.44 80.77,67.44
A12: length 7.5
  Top Layer w0.254: H2.2 U2.12
A15: length 7.5
  Top Layer w0.254: 73.28,72.52 80.77,72.52
B0: length 69.6
  Top Layer w0.254: v1(62.87,38.35) 62.87,67.18 62.61,67.44 58.04,67.44
  Bottom Layer w0.254: H4.4 80.14,19.05 71.63,19.05 70.74,19.94 70.74,37.34 69.72,38.35 v1(62.87,38.35)
B1: length 69.5
  Top Layer w0.254: v1(61.72,37.59) 61.72,64.77 61.59,64.9 U3.14
  Bottom Layer w0.254: H4.3 80.26,16.38 71.5,16.38 69.85,18.03 69.85,36.96 69.22,37.59 v1(61.72,37.59)
B3: length 7.5
  Top Layer w0.254: H2.4 U2.10
B4: length 7.5
  Top Layer w0.254: 73.28,77.6 80.77,77.6
B5: length 7.5
  Top Layer w0.254: H2.6 U2.8
B6: length 7.5
  Top Layer w0.254: U2.7 H2.7
B7: length 7.5
  Top Layer w0.254: H2.8 73.28,85.22
B8: length 7.5
  Top Layer w0.254: U2.5 H2.9
B9: length 7.5
  Top Layer w0.254: 73.28,90.3 H2.10
B10: length 68.5
  Top Layer w0.254: v1(60.58,36.58) 60.58,61.85 60.07,62.36 U3.15
  Bottom Layer w0.254: v1(60.58,36.58) 68.07,36.58 68.96,35.69 68.96,16.64 71.88,13.72 H4.2
B11: length 77.9
  Top Layer w0.254: v1(53.59,38.1) 53.59,59.44 53.97,59.82 U3.16
  Bottom Layer w0.254: v1(53.59,38.1) 53.59,35.94 54.1,35.43 67.44,35.43 68.07,34.8 68.07,12.95 69.72,11.3 80.26,11.3 H4.1
B12: length 34.9
  Top Layer w0.254: 73.28,49.66 73.28,22.22 74.17,21.34 H4.5
B13: length 34.7
  Top Layer w0.254: U2.19 74.93,52.2 75.56,51.56 75.56,24.64 76.45,23.75 80.26,23.75 H4.6
B14: length 34.1
  Top Layer w0.254: H4.7 78.36,26.42 76.71,28.07 76.71,54.1 76.07,54.74 73.28,54.74
B15: length 34.5
  Top Layer w0.254: H4.8 78.61,28.96 77.47,30.1 77.47,56.77 76.96,57.28 U2.17
C13: length 7.2
  Bottom Layer w0.254: H3.1 52.96,95.63 53.21,95.38 58.04,95.38
C14: length 12.1
  Bottom Layer w0.254: U3.3 49.02,92.84 48.39,93.47 H3.2
C15: length 15.7
  Bottom Layer w0.254: H3.3 45.85,93.47 47.24,92.08 53.59,92.08 55.37,90.3 58.04,90.3
IN+: length 54.6
  Top Layer w0.254: 32.65,51.31 30.35,51.31 29.46,50.42 29.46,40.26 26.42,37.21 v1(17.4,37.21) ; R9.1 v1(17.4,17.27)
  Top Layer w0.889: D1.1 14.77,17.27 R9.1
  Bottom Layer w0.254: v1(17.4,17.27) v1(17.4,37.21)
OUT+: length 46.3
  Top Layer w0.254: R6.2 23.71,85.68 24.26,86.23 29.08,86.23 29.97,85.34 32.57,85.34 32.64,85.41 34.35,85.41 34.54,85.22 34.54,84.07 35.11,83.5 U4.3
  Top Layer w0.889: 17.14,98.3 17.14,96.27 15.94,95.06 C9.1 15.94,83.79 C15.2 ; C15.2 R6.2 ; C15.2 15.85,83.03 13.84,81.03 13.84,77.99 13.83,77.98
VOUT: length 63.1
  Top Layer w0.254: 33.78,69.86 31.12,69.86 30.48,70.49 30.48,78.11 29.21,79.38 v1(18.54,79.38) ; 12.4,83.64 C15.1
  Top Layer w0.889: L3.2 12.4,83.64 ; P1.1 12.06,96.01 12.76,95.32 C9.2 12.76,85.91 12.45,85.6 12.45,83.79 C15.1
  Bottom Layer w0.254: v1(18.54,79.38) 13.33,79.38 12.35,80.36 C15.1
$1N156: length 9.6
  Top Layer w0.889: 10.29,2.79 10.37,2.88 D1.2
$1N2005: length 11.3
  Top Layer w0.254: 33.78,73.67 33.78,71.37 33.82,71.33 42.74,71.33
$1N2404: length 8.1
  Top Layer w0.254: 40.27,88.39 37.96,88.39 37.96,86.99 37.64,86.67 37.64,83.69 37.82,83.51 38.56,83.51 U4.4
$1N3649: length 35.3
  Top Layer w0.254: U6.3 24.26,30.1 23.75,30.61 12.83,30.61 12.43,31 Q3.3
  Top Layer w0.889: L2.1 12.41,52.07 D4.1 12.43,40.74 Q3.3
$1N4687: length 17.1
  Top Layer w0.889: L2.2 22.9,52.32 L3.1
$1N6608: length 5.2
  Top Layer w0.254: 36.77,53.55 36.69,53.47 34.15,53.47 34.17,53.48 34.17,56.01
$1N6687: length 5.2
  Top Layer w0.254: U7.4 36.73,51.31 34.15,51.31 34.15,48.77
$1N9222: length 7.6
  Top Layer w0.254: 19.3,32.27 25.28,32.27 25.53,32.51 U6.5
$1N9225: length 2.3
  Top Layer w0.254: 19.3,33.77 19.23,33.7 Q3.1

## Copper pours and planes (outline as drawn; the poured copper is in the pictures)
GND on Top Layer: 100.58,0.25 0.25,0.25 0.25,42.45 1.37,43.56 25.27,43.56 26.16,44.45 26.16,92.97 33.45,100.25 100.15,100.25 100.58,99.82
GND on Bottom Layer: 0.25,0.51 0.25,42.76 1.56,44.07 25.4,44.07 26.29,44.96 26.29,93.47 26.16,93.6 33.02,100.46 100.58,100.46 100.58,0.89 100.2,0.51

Small or netless copper shapes (teardrops, artwork), in the pictures only: 129 on Top Layer, 38 on Bottom Layer

## Text on the board
Top Silkscreen Layer: A7 | A6 | A5 | A4 | A0 | C15 | C14 | C13 | A15 | A12 | A11 | B9 | B8 | B7 | B6 | B4 | B3 | B5 | B1 | B10 | B11 | A10 | A9 | B15 | B14 | B12 | B0 | B13 | 3.3V | GND | A2 | A1 | V+ | V- | STM32F103 | 输入端 | 输出电流采样 | 输入电流采样 | 电压采样 | 输入20~28V 输出12V 1A / BUCK电路 | BUCK电感 | BUCK输出电容 | BUCK MOS管 | 防反 | 输入采样电阻 | 放电电阻 | BUCK续流二极管 | 输出采样电阻 | 辅助电源5V | 高端驱动 | 辅助电源3.3V
